# Altium schematic sheet Power.SchDoc
size A4
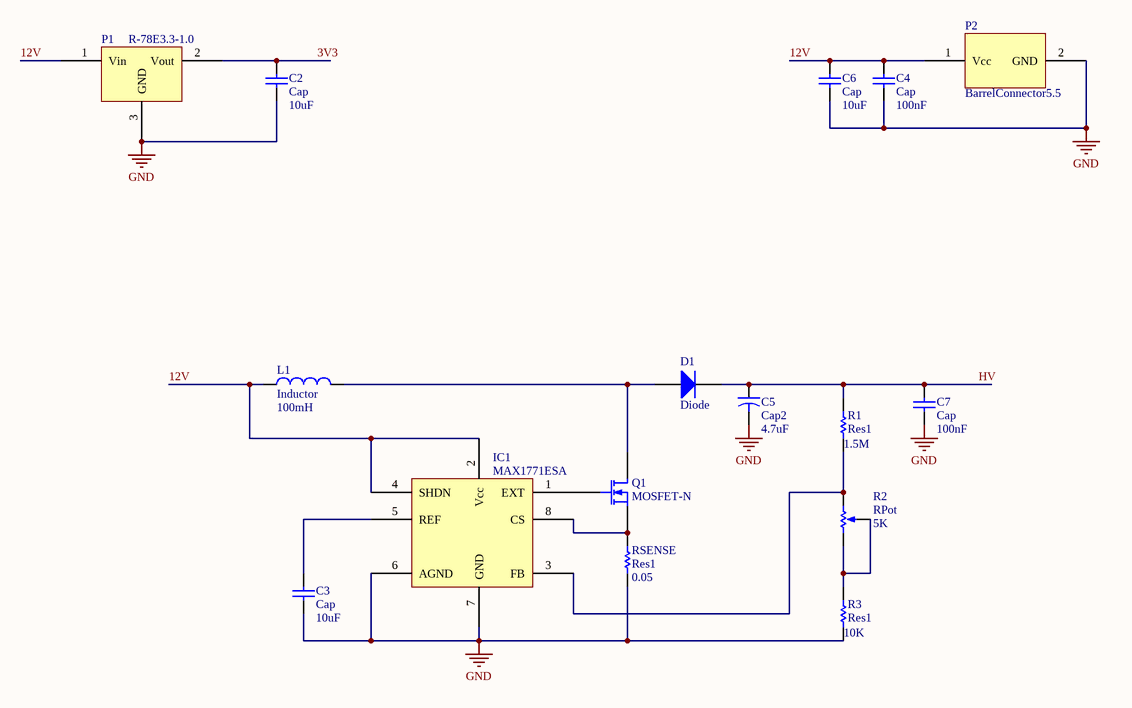
[diagram p0: Power.SchDoc]

## Parts
C2  Cap  value 10uF  [6-0805_M]
C3  Cap  value 10uF  [6-0805_M]
C4  Cap  value 100nF  [6-0805_M]
C5  Cap2  value 4.7uF  [G17]
C6  Cap  value 10uF  [6-0805_M]
C7  Cap  value 100nF  [Cap2420]
D1  Diode  [DO-214AA]
IC1  MAX1771ESA  [SOIC-8(1.27mm)]
L1  Inductor  value 100mH  [SMDInductor]
P1  R-78E3.3-1.0  [R-78E3.3-1.0]
P2  BarrelConnector5.5  [BarrelConnector5.5]
Q1  MOSFET-N  [TO-220-AB]
R1  Res1  value 1.5M  [Res2512]
R2  RPot  value 5K  [PVG3G]
R3  Res1  value 10K  [6-0805_M]
RSENSE  Res1  value 0.05  [Res2512]

## Nets
GND: C2.1 C3.1 C4.1 C5.2 C6.1 C7.1 IC1.6(AGND) IC1.7(GND) P1.3(GND) P2.2(GND) R3.1 RSENSE.1
3V3: C2.2 P1.2(Vout)
12V: C4.2 C6.2 IC1.2(Vcc) IC1.4(SHDN) L1.1 P1.1(Vin) P2.1(Vcc)
HV: C5.1 C7.2 D1.2(K) R1.2
NetC3_2: C3.2 IC1.5(REF)
NetD1_1: D1.1(A) L1.2 Q1.1(D)
NetIC1_1: IC1.1(EXT) Q1.2(G)
NetIC1_3: IC1.3(FB) R1.1 R2.2(BOT)
NetIC1_8: IC1.8(CS) Q1.3(S) RSENSE.2
NetR2_1: R2.1(TOP) R2.3(TAP) R3.2

## Library data of the parts
C2-C4 C6 C7 = Cap: Capacitor; Published: 8-Jun-2000; LatestRevisionDate: 17-Jul-2002; LatestRevisionNote: Re-released for DXP Platform.; PackageReference: RAD-0.3; Publisher: Altium Limited; PackageDescription: Radial Cap, Thru-Hole; 2 Leads; 0.3 in Pin Spacing
C5 = Cap2: Capacitor; Published: 23-Sep-2002; PackageReference: CAPR5-4X5; Publisher: Altium Limited; PackageDescription: Capacitor; 2 Leads
D1 = Diode: Default Diode; Published: 8-Jun-2000; LatestRevisionDate: 17-Jul-2002; LatestRevisionNote: Re-released for DXP Platform.; PackageVersion: Sep-1996; PackageReference: SMC; Publisher: Altium Limited; PackageDescription: DO-214-AB/SMC; 2 C-Bend Leads; Body 7.9 x 5.9 mm, inc. leads (LxW); Code_JEDEC: DO-214-AB
L1 = Inductor: Code_IEC: 1005; Published: 8-Jun-2000; LatestRevisionDate: 29-May-2009; LatestRevisionNote: IPC-7351 Footprint Added.; PackageReference: 0402-A; Publisher: Altium Limited; PackageDescription: Chip Inductor; Code_JEITA: 0402
Q1 = MOSFET-N: N-Channel MOSFET; pin to pad: 1>2 2>1; Published: 8-Jun-2000; LatestRevisionDate: 17-Jul-2002; LatestRevisionNote: Re-released for DXP Platform.; PackageVersion: 1995/1996; PackageReference: E3; Publisher: Altium Limited; PackageDescription: TO, Flat Index; 3 In-Line, Axial Leads; Body Dia. 4.6mm; Lead Dia. 0.5 mm (max)
R1 R3 RSENSE = Res1: Resistor; Published: 8-Jun-2000; LatestRevisionDate: 17-Jul-2002; LatestRevisionNote: Re-released for DXP Platform.; PackageReference: AXIAL-0.3; Publisher: Altium Limited; PackageDescription: Axial Device, Thru-Hole; 2 Leads; 0.3 in Pin Spacing
R2 = RPot: Potentiometer; pin to pad: 2>3 3>2; Sim Note: Enter the Resistance value and the set point into parameter fields.; Set Position: 0.5; Published: 8-Jun-2000; LatestRevisionDate: 17-Jul-2002; LatestRevisionNote: Re-released for DXP Platform.; PackageReference: VR5; Publisher: Altium Limited; PackageDescription: Variable Resistor, Thru-Hole; 3 Leads